# Altium schematic sheet AuxPowerSupply.SchDoc: AUX PSU
size 420 x 297 mm; CheckedBy: G.Kasprowicz; DrawnBy: M.Gaska; Address1: PW ISE; Address2: Nowowiejska 15/19 00-665 Warsaw; Address3: michalgaska2@gmail.com; DocumentNumber: 1; SheetNumber: 1; SheetTotal: 9; EDA_Number: ARTIQ; Projet: AUX PSU; ModifiedBy: M. Fafara; CheckedDate: -; Title2: v2.0; DivGrp: WUT ISE; Designer: M.Gaska
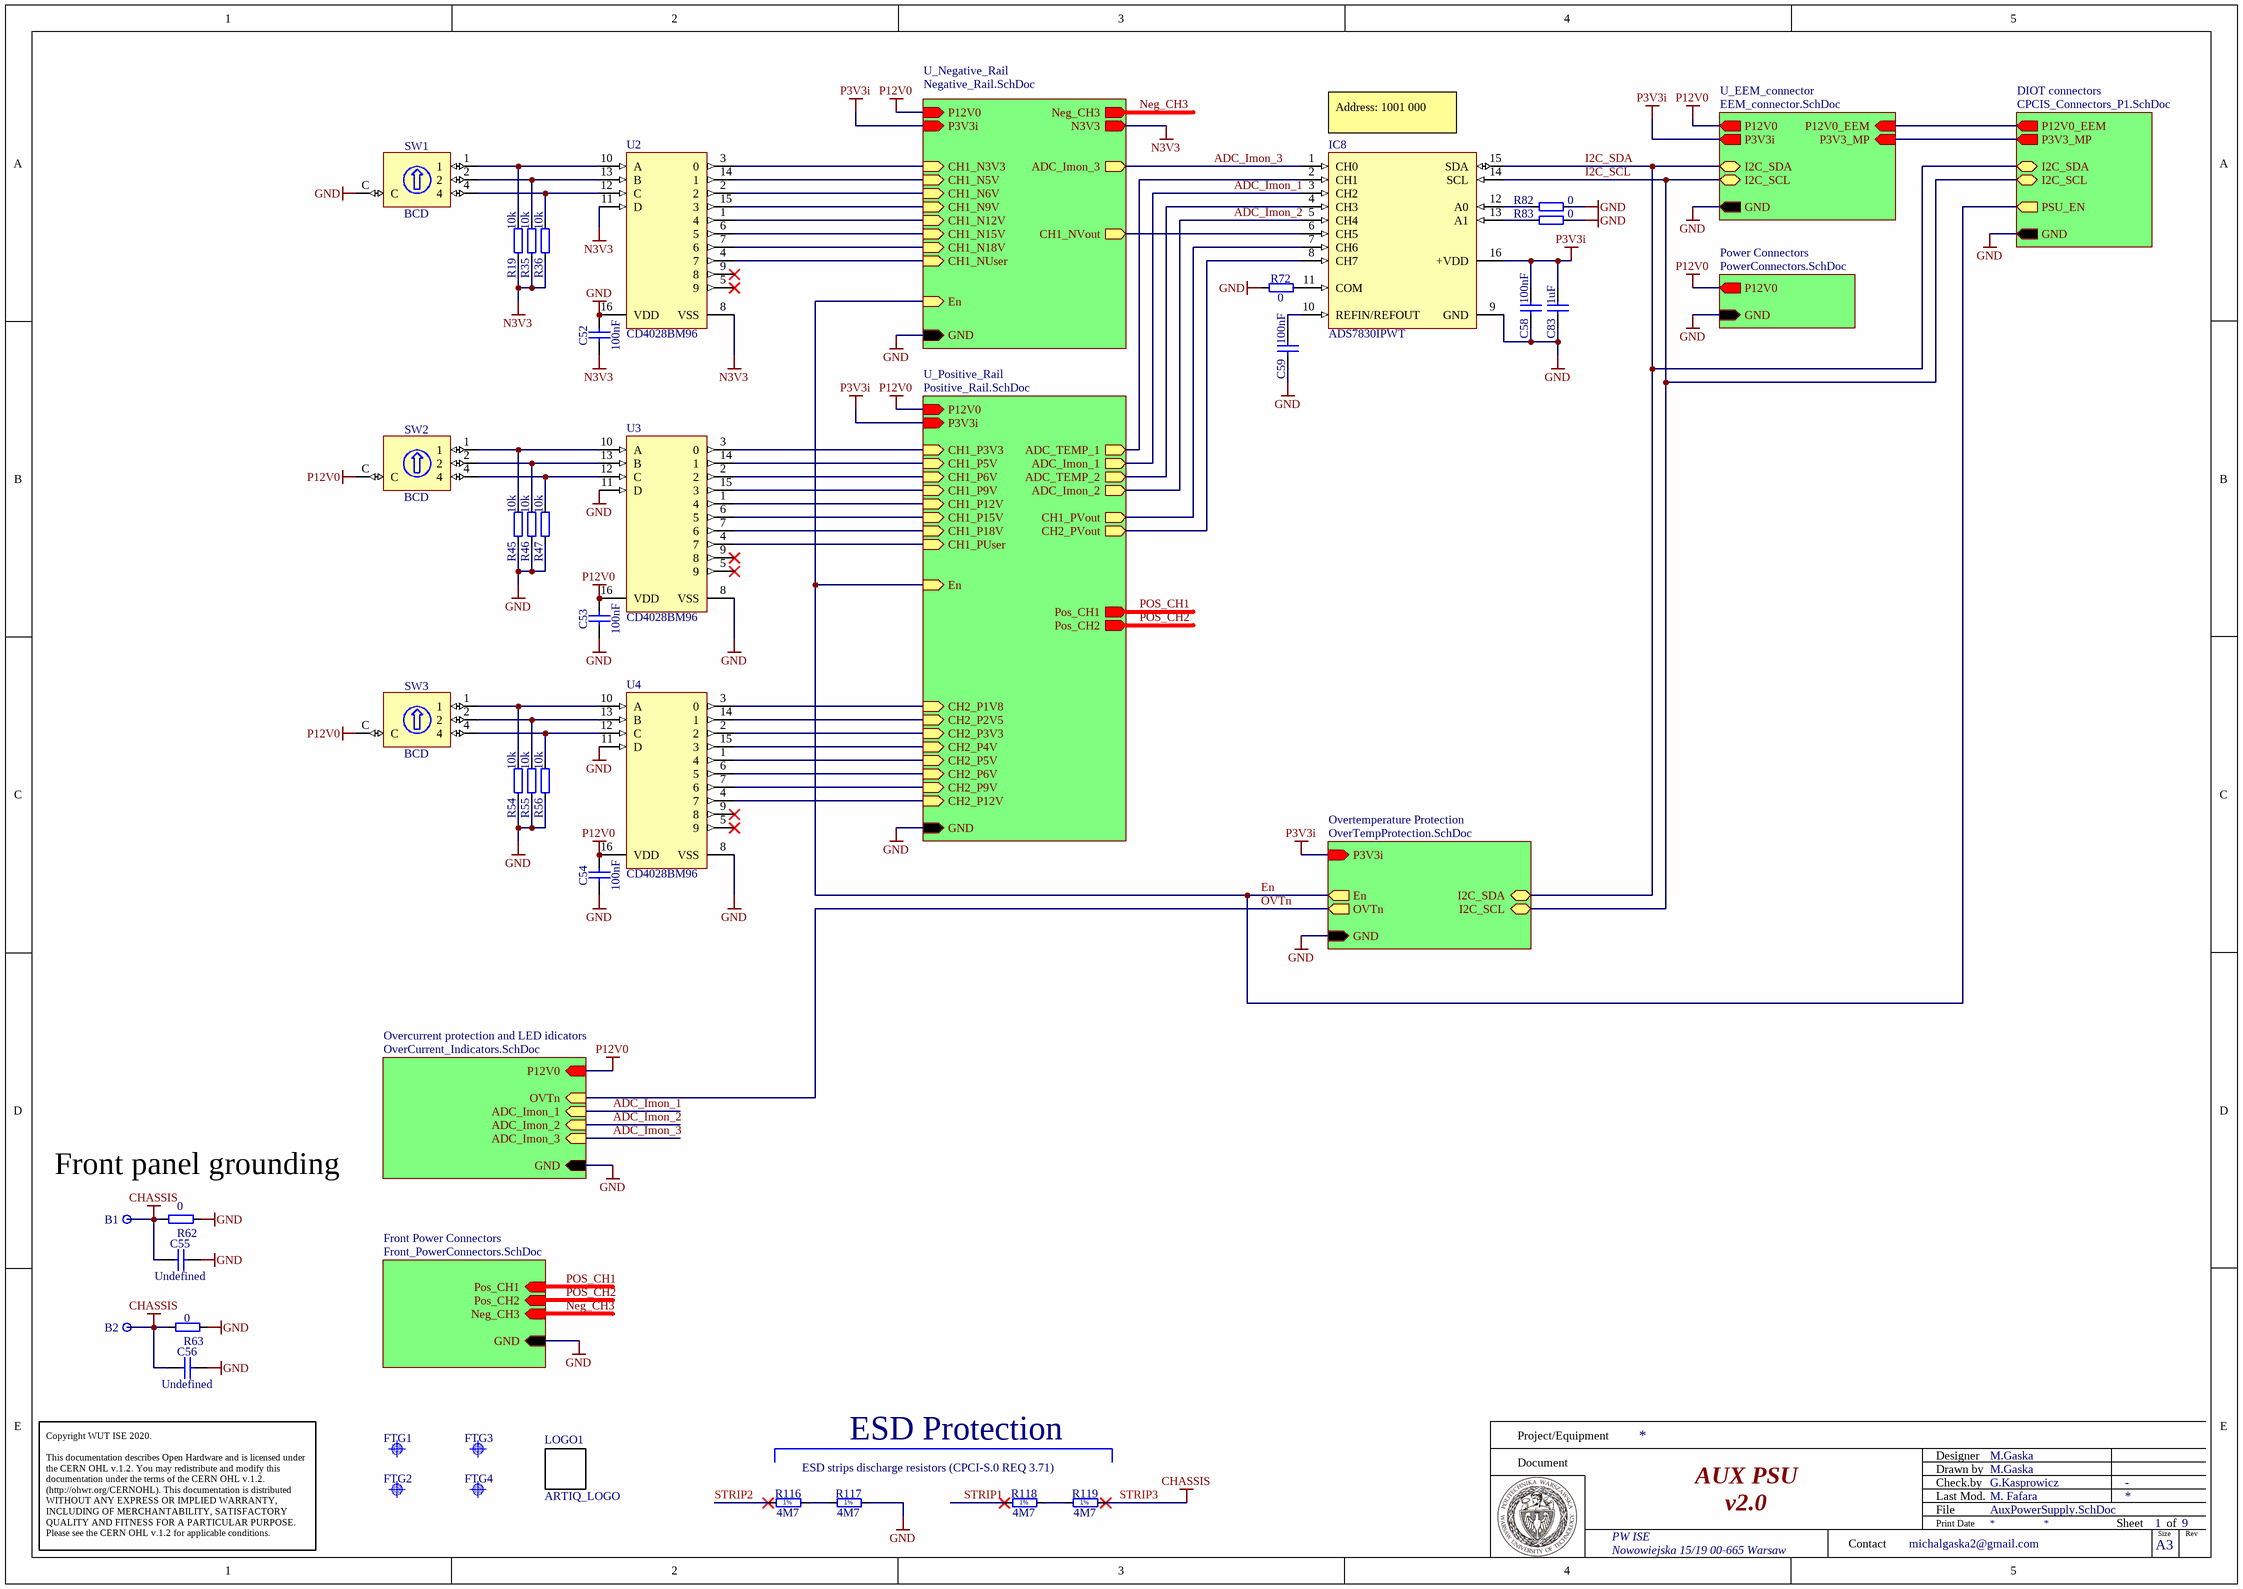
[diagram p0: AuxPowerSupply.SchDoc]

## Parts
B1  (no value)  [MTG270_500]  (no BOM)
B2  (no value)  [MTG270_500]  (no BOM)
C52  100nF  [CAPC1608X87N]
C53  100nF  [CAPC1608X87N]
C54  100nF  [CAPC1608X87N]
C55  Undefined  [CAPC2012X135N]
C56  Undefined  [CAPC2012X135N]
C58  100nF  [CAPC1608X87N]
C59  100nF  [CAPC1608X87N]
C83  1uF  [CAPC1608X87N]
FTG1  (no value)  [FIDUCIAL_TOP_C100-200]
FTG2  (no value)  [FIDUCIAL_TOP_S100-200]
FTG3  (no value)  [FIDUCIAL_TOP_S100-200]
FTG4  (no value)  [FIDUCIAL_TOP_S100-200]
IC8  ADS7830IPWT  [SOP65P640X120-16N]
LOGO1  ARTIQ_LOGO  [ARTIQ_Logo]  (no BOM)
R19  10k  [RESC1608X55N]
R35  10k  [RESC1608X55N]
R36  10k  [RESC1608X55N]
R45  10k  [RESC1608X55N]
R46  10k  [RESC1608X55N]
R47  10k  [RESC1608X55N]
R54  10k  [RESC1608X55N]
R55  10k  [RESC1608X55N]
R56  10k  [RESC1608X55N]
R62  0  [RESC1608X55N]
R63  0  [RESC1608X55N]
R72  0  [RESC1608X55N]
R82  0  [RESC1608X55N]
R83  0  [RESC1608X55N]
R116  4M7  [RESC2113X55N]
R117  4M7  [RESC2113X55N]
R118  4M7  [RESC2113X55N]
R119  4M7  [RESC2113X55N]
SW1  BCD  [SW_NIDEC-COPAL-ELECTRONICS_S-81X1]
SW2  BCD  [SW_NIDEC-COPAL-ELECTRONICS_S-81X1]
SW3  BCD  [SW_NIDEC-COPAL-ELECTRONICS_S-81X1]
U2  CD4028BM96  [D0016A_M]
U3  CD4028BM96  [D0016A_M]
U4  CD4028BM96  [D0016A_M]

## Sub-sheets
DIOT connectors = CPCIS_Connectors_P1.SchDoc: I2C_SDA (bidir), I2C_SCL (bidir), GND (out), P12V0_EEM (out), P3V3_MP (out), PSU_EN (out)
Front Power Connectors = Front_PowerConnectors.SchDoc: Pos_CH1 (in), Pos_CH2 (in), Neg_CH3 (in), GND (in)
Overcurrent protection and LED idicators = OverCurrent_Indicators.SchDoc: P12V0 (in), GND (in), OVTn (in), ADC_Imon_3 (in), ADC_Imon_2 (in), ADC_Imon_1 (in)
Overtemperature Protection = OverTempProtection.SchDoc: P3V3i (in), GND (in), I2C_SDA (bidir), I2C_SCL (bidir), En (out), OVTn (out)
Power Connectors = PowerConnectors.SchDoc: GND (in), P12V0 (out)
U_EEM_connector = EEM_connector.SchDoc: I2C_SDA (bidir), I2C_SCL (bidir), P12V0 (out), P3V3i (out), GND (out), P12V0_EEM (in), P3V3_MP (in)
U_Negative_Rail = Negative_Rail.SchDoc: CH1_N18V (in), CH1_N5V (in), CH1_N9V (in), CH1_N12V (in), CH1_N15V (in), ADC_Imon_3 (out), CH1_NVout (out), CH1_N3V3 (in), CH1_NUser (in), CH1_N6V (in), En (in), GND (in), P12V0 (in), P3V3i (in), Neg_CH3 (out), N3V3 (out)
U_Positive_Rail = Positive_Rail.SchDoc: CH2_P6V (in), CH2_P3V3 (in), CH2_P4V (in), CH1_P15V (in), CH1_P9V (in), CH1_P12V (in), CH2_P5V (in), CH1_P5V (in), CH1_P18V (in), ADC_TEMP_2 (out), ADC_Imon_2 (out), ADC_Imon_1 (out), ADC_TEMP_1 (out), CH1_PVout (out), CH2_PVout (out), CH2_P2V5 (in), CH1_P3V3 (in), CH2_P1V8 (in), CH1_PUser (in), CH2_P9V (in), CH1_P6V (in), CH2_P12V (in), En (in), P12V0 (in), GND (in), Pos_CH1 (out), Pos_CH2 (out), P3V3i (in)

## Nets
GND: C52.2 C53.1 C54.1 C55.2 C56.2 C58.1 C59.1 C83.1 IC8.9(GND) R45.1 R46.1 R47.1 R54.1 R55.1 R56.1 R62.1 R63.1 R72.1 R82.2 R83.2 R117.2 SW1.C U2.16(VDD) U3.8(VSS) U3.11(D) U4.8(VSS) U4.11(D) ; sheet U_Negative_Rail/GND, sheet U_Positive_Rail/GND, sheet U_EEM_connector/GND, sheet Power Connectors/GND, sheet Overcurrent protection and LED idicators/GND, sheet Front Power Connectors/GND, sheet Overtemperature Protection/GND, sheet DIOT connectors/GND
N3V3: C52.1 R19.1 R35.1 R36.1 U2.8(VSS) U2.11(D) ; sheet U_Negative_Rail/N3V3
P3V3i: C58.2 C83.2 IC8.16(+VDD) ; sheet U_Negative_Rail/P3V3i, sheet U_Positive_Rail/P3V3i, sheet U_EEM_connector/P3V3i, sheet Overtemperature Protection/P3V3i
P12V0: C53.2 C54.2 SW2.C SW3.C U3.16(VDD) U4.16(VDD) ; sheet U_Negative_Rail/P12V0, sheet U_Positive_Rail/P12V0, sheet U_EEM_connector/P12V0, sheet Power Connectors/P12V0, sheet Overcurrent protection and LED idicators/P12V0
STRIP3: B1.1 B2.1 C55.1 C56.1 R62.2 R63.2 R119.2  [also labelled CHASSIS]
ADC_Imon_1: IC8.3(CH2) ; sheet U_Positive_Rail/ADC_Imon_1, sheet Overcurrent protection and LED idicators/ADC_Imon_1
ADC_Imon_2: IC8.5(CH4) ; sheet U_Positive_Rail/ADC_Imon_2, sheet Overcurrent protection and LED idicators/ADC_Imon_2
ADC_Imon_3: IC8.1(CH0) ; sheet U_Negative_Rail/ADC_Imon_3, sheet Overcurrent protection and LED idicators/ADC_Imon_3
En: sheet U_Negative_Rail/En, sheet U_Positive_Rail/En, sheet Overtemperature Protection/En, sheet DIOT connectors/PSU_EN
I2C_SCL: IC8.14(SCL) ; sheet U_EEM_connector/I2C_SCL, sheet Overtemperature Protection/I2C_SCL, sheet DIOT connectors/I2C_SCL
I2C_SDA: IC8.15(SDA) ; sheet U_EEM_connector/I2C_SDA, sheet Overtemperature Protection/I2C_SDA, sheet DIOT connectors/I2C_SDA
Neg_CH3: sheet U_Negative_Rail/Neg_CH3, sheet Front Power Connectors/Neg_CH3
OVTn: sheet Overcurrent protection and LED idicators/OVTn, sheet Overtemperature Protection/OVTn
POS_CH1: sheet U_Positive_Rail/Pos_CH1, sheet Front Power Connectors/Pos_CH1
POS_CH2: sheet U_Positive_Rail/Pos_CH2, sheet Front Power Connectors/Pos_CH2
STRIP1: R118.1
STRIP2: R116.1
NetC59_2: C59.2 IC8.10(REFIN/REFOUT)
NetIC8_2: IC8.2(CH1) ; sheet U_Positive_Rail/ADC_TEMP_1
NetIC8_4: IC8.4(CH3) ; sheet U_Positive_Rail/ADC_TEMP_2
NetIC8_6: IC8.6(CH5) ; sheet U_Negative_Rail/CH1_NVout
NetIC8_7: IC8.7(CH6) ; sheet U_Positive_Rail/CH1_PVout
NetIC8_8: IC8.8(CH7) ; sheet U_Positive_Rail/CH2_PVout
NetIC8_11: IC8.11(COM) R72.2
NetIC8_12: IC8.12(A0) R82.1
NetIC8_13: IC8.13(A1) R83.1
NetR19_2: R19.2 SW1.1 U2.10(A)
NetR35_2: R35.2 SW1.2 U2.13(B)
NetR36_2: R36.2 SW1.4 U2.12(C)
NetR45_2: R45.2 SW2.1 U3.10(A)
NetR46_2: R46.2 SW2.2 U3.13(B)
NetR47_2: R47.2 SW2.4 U3.12(C)
NetR54_2: R54.2 SW3.1 U4.10(A)
NetR55_2: R55.2 SW3.2 U4.13(B)
NetR56_2: R56.2 SW3.4 U4.12(C)
NetR116_2: R116.2 R117.1
NetR118_2: R118.2 R119.1
NetU2_1: U2.1(4) ; sheet U_Negative_Rail/CH1_N12V
NetU2_2: U2.2 ; sheet U_Negative_Rail/CH1_N6V
NetU2_3: U2.3(0) ; sheet U_Negative_Rail/CH1_N3V3
NetU2_4: U2.4(7) ; sheet U_Negative_Rail/CH1_NUser
NetU2_6: U2.6(5) ; sheet U_Negative_Rail/CH1_N15V
NetU2_7: U2.7(6) ; sheet U_Negative_Rail/CH1_N18V
NetU2_14: U2.14(1) ; sheet U_Negative_Rail/CH1_N5V
NetU2_15: U2.15(3) ; sheet U_Negative_Rail/CH1_N9V
NetU3_1: U3.1(4) ; sheet U_Positive_Rail/CH1_P12V
NetU3_2: U3.2 ; sheet U_Positive_Rail/CH1_P6V
NetU3_3: U3.3(0) ; sheet U_Positive_Rail/CH1_P3V3
NetU3_4: U3.4(7) ; sheet U_Positive_Rail/CH1_PUser
NetU3_6: U3.6(5) ; sheet U_Positive_Rail/CH1_P15V
NetU3_7: U3.7(6) ; sheet U_Positive_Rail/CH1_P18V
NetU3_14: U3.14(1) ; sheet U_Positive_Rail/CH1_P5V
NetU3_15: U3.15(3) ; sheet U_Positive_Rail/CH1_P9V
NetU4_1: U4.1(4) ; sheet U_Positive_Rail/CH2_P5V
NetU4_2: U4.2 ; sheet U_Positive_Rail/CH2_P3V3
NetU4_3: U4.3(0) ; sheet U_Positive_Rail/CH2_P1V8
NetU4_4: U4.4(7) ; sheet U_Positive_Rail/CH2_P12V
NetU4_6: U4.6(5) ; sheet U_Positive_Rail/CH2_P6V
NetU4_7: U4.7(6) ; sheet U_Positive_Rail/CH2_P9V
NetU4_14: U4.14(1) ; sheet U_Positive_Rail/CH2_P2V5
NetU4_15: U4.15(3) ; sheet U_Positive_Rail/CH2_P4V
(unnamed): sheet U_EEM_connector/P12V0_EEM, sheet DIOT connectors/P12V0_EEM
(unnamed): sheet U_EEM_connector/P3V3_MP, sheet DIOT connectors/P3V3_MP

Not connected (* = marked no-connect by the designer): U2 5(9)* 9(8)*; U3 5(9)* 9(8)*; U4 5(9)* 9(8)*

## Notes on the sheet
- (near IC8) Address: 1001 000
- Front panel grounding
- ESD strips discharge resistors (CPCI-S.0 REQ 3.71)
- ESD Protection
- Project/Equipment
- Document
- Designer
- Drawn by
- Check.by
- Copyright WUT ISE 2020.
  This documentation describes Open Hardware and is licensed under the CERN OHL v.1.2. You may redistribute and modify this documentation under the terms of the CERN OHL v.1.2. (http://ohwr.org/CERNOHL). This documentation is distributed WITHOUT ANY EXPRESS OR IMPLIED WARRANTY, INCLUDING OF MERCHANTABILITY, SATISFACTORY QUALITY AND FITNESS FOR A PARTICULAR PURPOSE. Please see the CERN OHL v.1.2 for applicable conditions.
- Contact
- File
- Last Mod.
- Print Date
- Sheet
- Size
- A3
- of
- Rev
- (in symbol R0805_4M7_1%_0.125W_100PPM_VISHAY_CRCW e3) 1%

## Library data of the parts
B1 B2 = PLATED_HOLE2.7_PAD5.0: Single Terminal Socket; Part Description: Plated Through Hole: Hole Dia.=2.7mm Pad Dia.=5.0mm; Mounted: No; Part Number: PLATED_HOLE2.7_PAD5.0; Component Type: Standard (No BOM); Pin Count: 1; Family: Plated Hole; Socket: No; SMD: No; Sense: No; Status: None; ComponentHeight: 0mm; HelpURL: Undefined; Author: CERN DEM JMW; CreateDate: 27.09.2011; LatestRevisionDate: 27.09.2011; PackageDescription: Plated Through Hole: Hole Dia.=2.7mm Pad Dia.=5.0mm
C52-C54 C58 C59 = CC0603_100NF_50V_10%_X5R: Non-polarised capacitor; Part Description: SMD Multilayer Chip Ceramic Capacitor; Manufacturer: GENERIC; Manufacturer1 Part Number: C1608X5R1H104K080; Voltage: 50V; TC: X5R; Tolerance: ±10%; Part Number: CC0603_100NF_50V_10%_X5R; Component Kind: Standard; Component Type: Standard; Pin Count: 2; Value: 100nF; Status: None; Manufacturer Part Number: CC0603_100NF_50V_10%_X5R; Case: 0603; Mounted: Yes; Socket: No; SMD: Yes; Sense: No; Manufacturer1 Example: TDK; Manufacturer1 ComponentHeight: 0.9mm; HelpURL: \\cern.ch\dfs\Applications\Altium\Datasheets\CC0603_X5R_TDK_C.pdf; Author: CERN DEM MR; CreateDate: 08.01.2016; LatestRevisionDate: 08.01.2016
C55 C56 = CC0805_NO-VALUE: Non-polarised capacitor; Part Description: Reserved Footprint For 0805(2012) Chip Ceramic Capacitor; Mounted: No; Part Number: CC0805_NO-VALUE; Component Kind: Standard; Component Type: Standard; Pin Count: 2; Value: Undefined; Status: None; Manufacturer: Undefined; Manufacturer Part Number: CC0805_NO-VALUE; Case: 0805; Socket: No; SMD: Yes; Sense: No; Manufacturer1 ComponentHeight: 1.35mm; HelpURL: Undefined; Author: CERN DEM JLC; CreateDate: 10.12.2008; LatestRevisionDate: 11.09.2013
C83 = CC0603_1UF_25V_10%_X7R: Non-polarised capacitor; Part Description: SMD Multilayer Chip Ceramic Capacitor; Manufacturer: GENERIC; Manufacturer1 Part Number: GRM188R71E105KA12D; Voltage: 25V; TC: X7R; Tolerance: ±10%; Part Number: CC0603_1UF_25V_10%_X7R; Component Kind: Standard; Component Type: Standard; Pin Count: 2; Value: 1uF; Status: None; Manufacturer Part Number: CC0603_1UF_25V_10%_X7R; Case: 0603; Mounted: Yes; Socket: No; SMD: Yes; Sense: No; Manufacturer1 Example: MURATA; Manufacturer1 ComponentHeight: 0.9mm; HelpURL: \\cern.ch\dfs\Applications\Altium\Datasheets\CC0603_X7R_MURATA.pdf; Author: CERN DEM JLC; CreateDate: 18.01.2011; LatestRevisionDate: 18.01.2011
FTG1 = FIDUCIAL_TARGET_C100-200: Fiducial Target; Part Description: Round Fiducial Target, Top Layer, 1.0mm, Top Solder 2.0mm, Keepout =2.0mm; Mounted: No; Part Number: FIDUCIAL_TARGET_C100-200; Component Kind: Standard (No BOM); Component Type: Standard (No BOM); Pin Count: 1; Family: Fiducial; Socket: No; SMD: Yes; Sense: No; Status: None; ComponentHeight: 0mm; HelpURL: Undefined; Author: CERN DEM JLC; CreateDate: 09.02.2010; LatestRevisionDate: 04.04.2012; PackageDescription: Round Fiducial Target, Top Layer, 1.0mm, Top Solder 2.0mm, Keepout =2.0mm
FTG2-FTG4 = FIDUCIAL_TARGET_S100-200: Fiducial Target; Part Description: Square Fiducial Target, Top Layer, 1.0mm, Top Solder 2.0mm, Keepout =2.0mm; Mounted: No; Part Number: FIDUCIAL_TARGET_S100-200; Component Kind: Standard (No BOM); Component Type: Standard (No BOM); Pin Count: 1; Family: Fiducial; Socket: No; SMD: Yes; Sense: No; Status: None; ComponentHeight: 0mm; HelpURL: Undefined; Author: CERN DEM JLC; CreateDate: 09.02.2010; LatestRevisionDate: 04.04.2012; PackageDescription: Square Fiducial Target, Top Layer, 1.0mm, Top Solder 2.0mm, Keepout =2.0mm
IC8 = ADS7830IPWT: 8-Bit, 8-Channel Sampling A/D Converter with I2C Interface 16-TSSOP -40 to 85; MF: Texas Instruments; Package: TSSOP-16 Texas Instruments; Availability: Unavailable; Value: *; MP: ADS7830IPWT; Price: None; Manufacturer Part Number: ADS7830IPWT
LOGO1 = CMP-00028-00007-2: ARTIQ logo to place on the PCB
R19 R35 R36 R45-R47 R54-R56 = R0603_10K_1%_0.1W_100PPM: Resistor - 1%; Part Description: General Purpose Thick Film Chip Resistor; Manufacturer: GENERIC; Manufacturer1 Part Number: NRC06F1002TRF; Power: 0.1W; TC: ±100ppm/°C; PressFit: No; Part Number: R0603_10K_1%_0.1W_100PPM; Component Kind: Standard; Component Type: Standard; Pin Count: 2; Value: 10k; Status: Preferred; Tolerance: ±1%; Manufacturer Part Number: R0603_10K_1%_0.1W_100PPM; Case: 0603; Mounted: Yes; Sense: No; Socket: No; SMD: Yes; Manufacturer1 Example: NIC COMPONENT; Manufacturer1 ComponentHeight: 0.55mm; HelpURL: \\cern.ch\dfs\Applications\Altium\Datasheets\R0603_NIC_NRC.pdf; Author: CERN DEM JLC; CreateDate: 03.12.2007; LatestRevisionDate: 13.03.2008
R62 R63 R72 R82 R83 = R0603_0R_JUMPER: Resistor; Part Description: 1A (0.05R Max DC Resistance) Zero Ohm Jumper; Manufacturer: GENERIC; Manufacturer1 Part Number: NRC06Z0; PressFit: No; Part Number: R0603_0R_JUMPER; Component Kind: Standard; Component Type: Standard; Pin Count: 2; Value: 0; Status: Preferred; Manufacturer Part Number: R0603_0R_JUMPER; Case: 0603; Mounted: Yes; Sense: No; Socket: No; SMD: Yes; Manufacturer1 Example: NIC COMPONENT; Manufacturer1 ComponentHeight: 0.55mm; HelpURL: \\cern.ch\dfs\Applications\Altium\Datasheets\R0603_NIC_NRC.pdf; Author: CERN DEM JLC; CreateDate: 03.12.2007; LatestRevisionDate: 13.03.2008
R116-R119 = R0805_4M7_1%_0.125W_100PPM_VISHAY_CRCW e3: Resistor - 1%; Part Description: 150V, Standard Thick Film Chip Resistor; Manufacturer: VISHAY; Manufacturer Part Number: CRCW08054M70FKEA; Power: 0.125W; TC: ±100ppm/°C; PressFit: No; Part Number: R0805_4M7_1%_0.125W_100PPM_VISHAY_CRCW e3; Component Kind: Standard; Component Type: Standard; Pin Count: 2; Value: 4M7; Status: None; Tolerance: ±1%; Case: 0805; Mounted: Yes; Sense: No; Socket: No; SMD: Yes; ComponentHeight: 0.5mm; HelpURL: \\cern.ch\dfs\Applications\Altium\Datasheets\R0805_VISHAY_CRCW e3.pdf; Author: CERN DEM BR; CreateDate: 27.05.2019; LatestRevisionDate: 27.05.2019
SW1-SW3 = SW_Rotary_S-8111: Rotary Code Switch 1 2 4 C; Part Number: SW_NIDEC-COPAL-ELECTRONICS_S-8111; Part Description: Body 7.2x7.2mm, Right Angled Rotary Real Code 8 Positions Switch, NIDEC-COPAL-ELECTRONICS (S-8000) Series; Manufacturer: NIDEC-COPAL-ELECTRONICS; Manufacturer Part Number: S-8111; PressFit: No; Component Kind: Standard; Component Type: Standard; Pin Count: 4; PackageDescription: Body 7.2x7.2mm, Right Angled Rotary 8 Positions Switch, NIDEC-COPAL-ELECTRONICS (S-8000) Series; Family: BCD; Mounted: Yes; Socket: No; SMD: No; Sense: No; Status: None; ComponentHeight: 7.2mm; HelpURL: \\cern.ch\dfs\Applications\Altium\Datasheets\SW_NIDEC-COPAL-ELECTRONICS_S-8000.pdf; Author: CERN DEM BC; CreateDate: 06.11.2020; LatestRevisionDate: 06.11.2020
U2-U4 = CMP-015-00008-1: Decimal Decoder/Driver, 4000/14000/40000 Series, True Output, CMOS, PDSO16; Min Supply Voltage: 3V; Max Supply Voltage: 18V; Min Operating Temperature: -55°C; Case/Package: SOP; Pins: 16; Max Operating Temperature: 125°C; RoHS Compliant: Yes